# EAGLE schematic Grove - OLED Display 0.96 (SSD1315)_v1.0 (EAGLE 9.4.2)

## Sheet 1 of 2
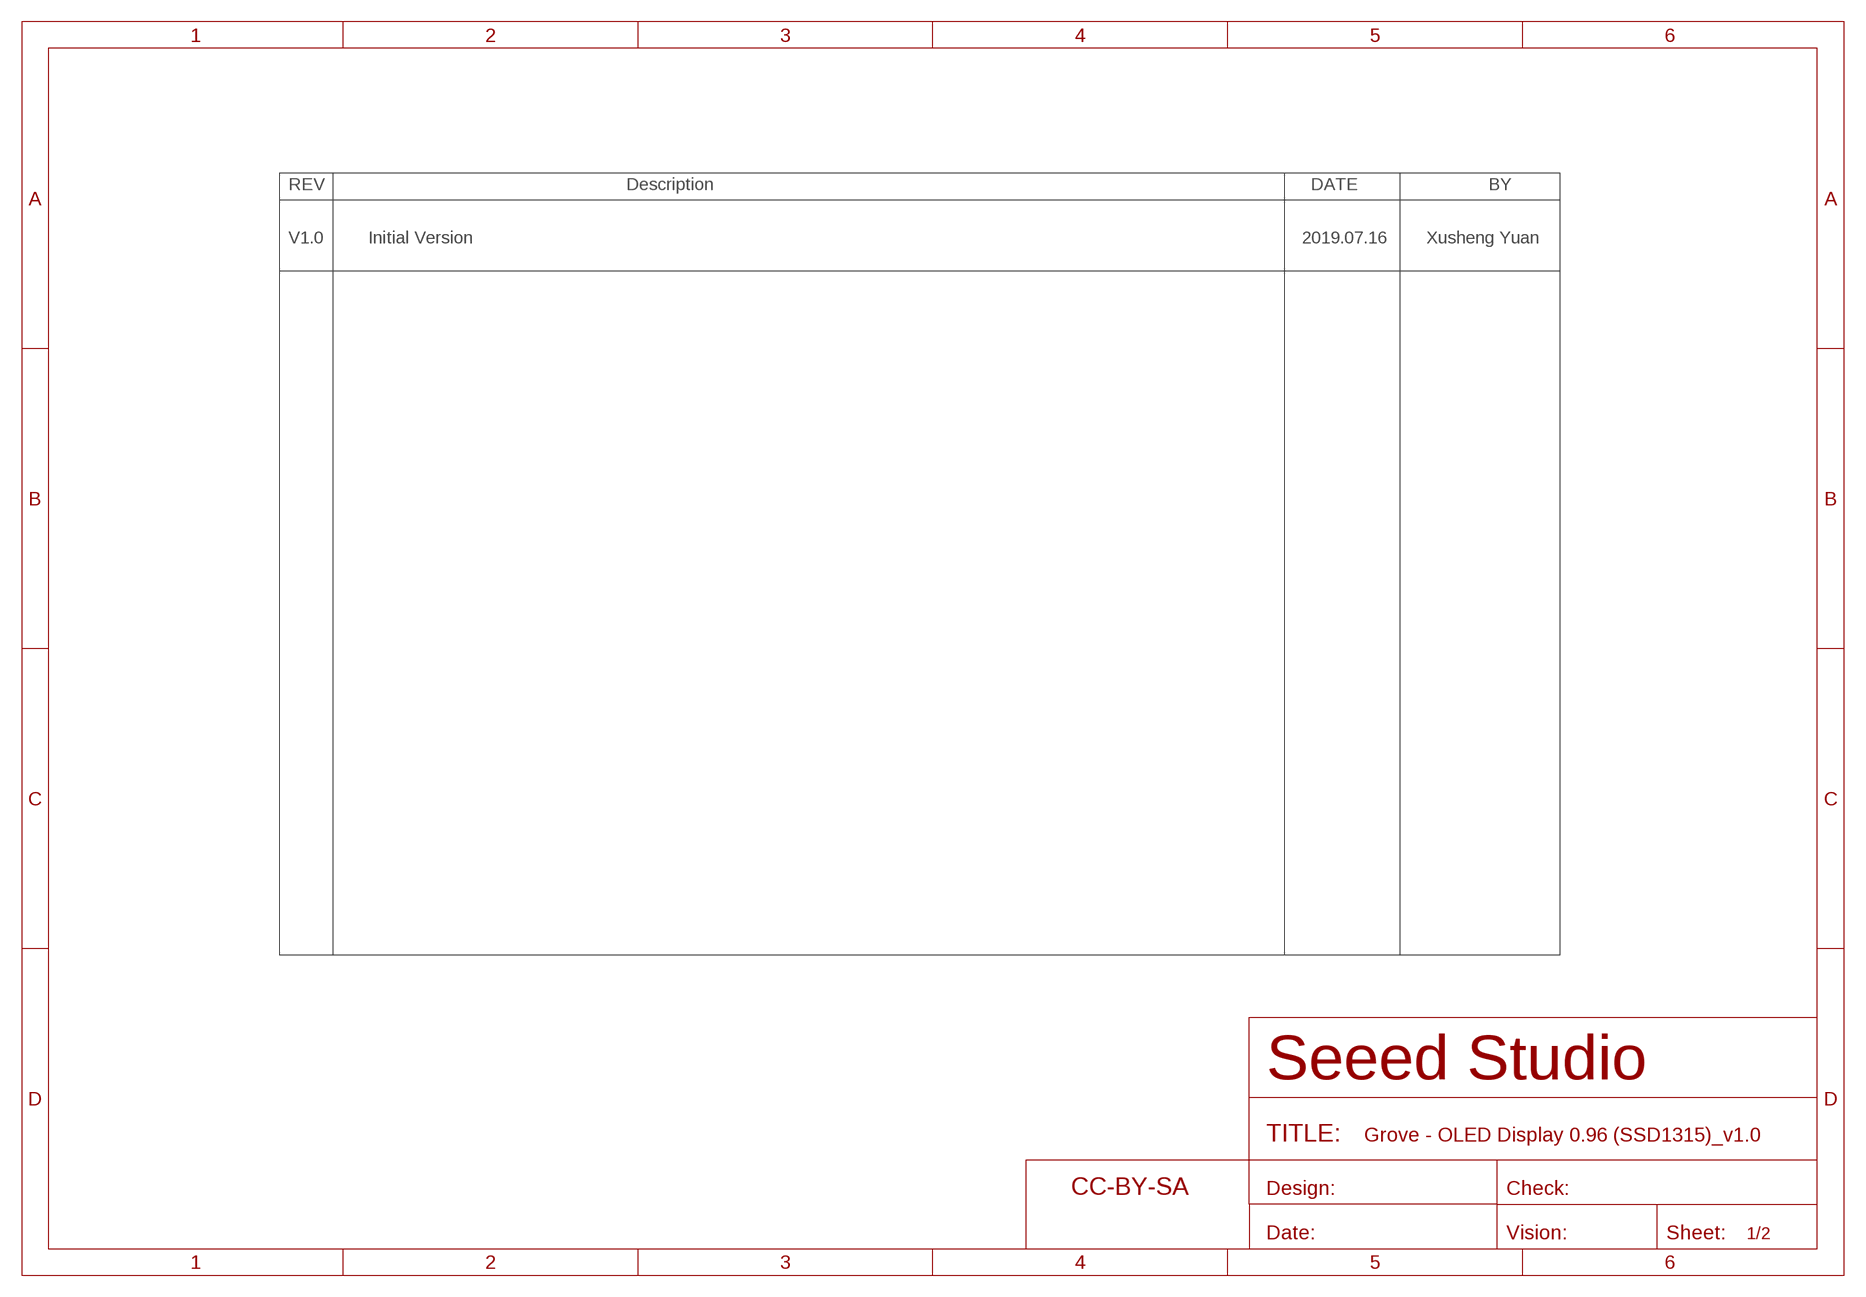
[diagram p0: schematic, sheet 1, part 1 of 2]
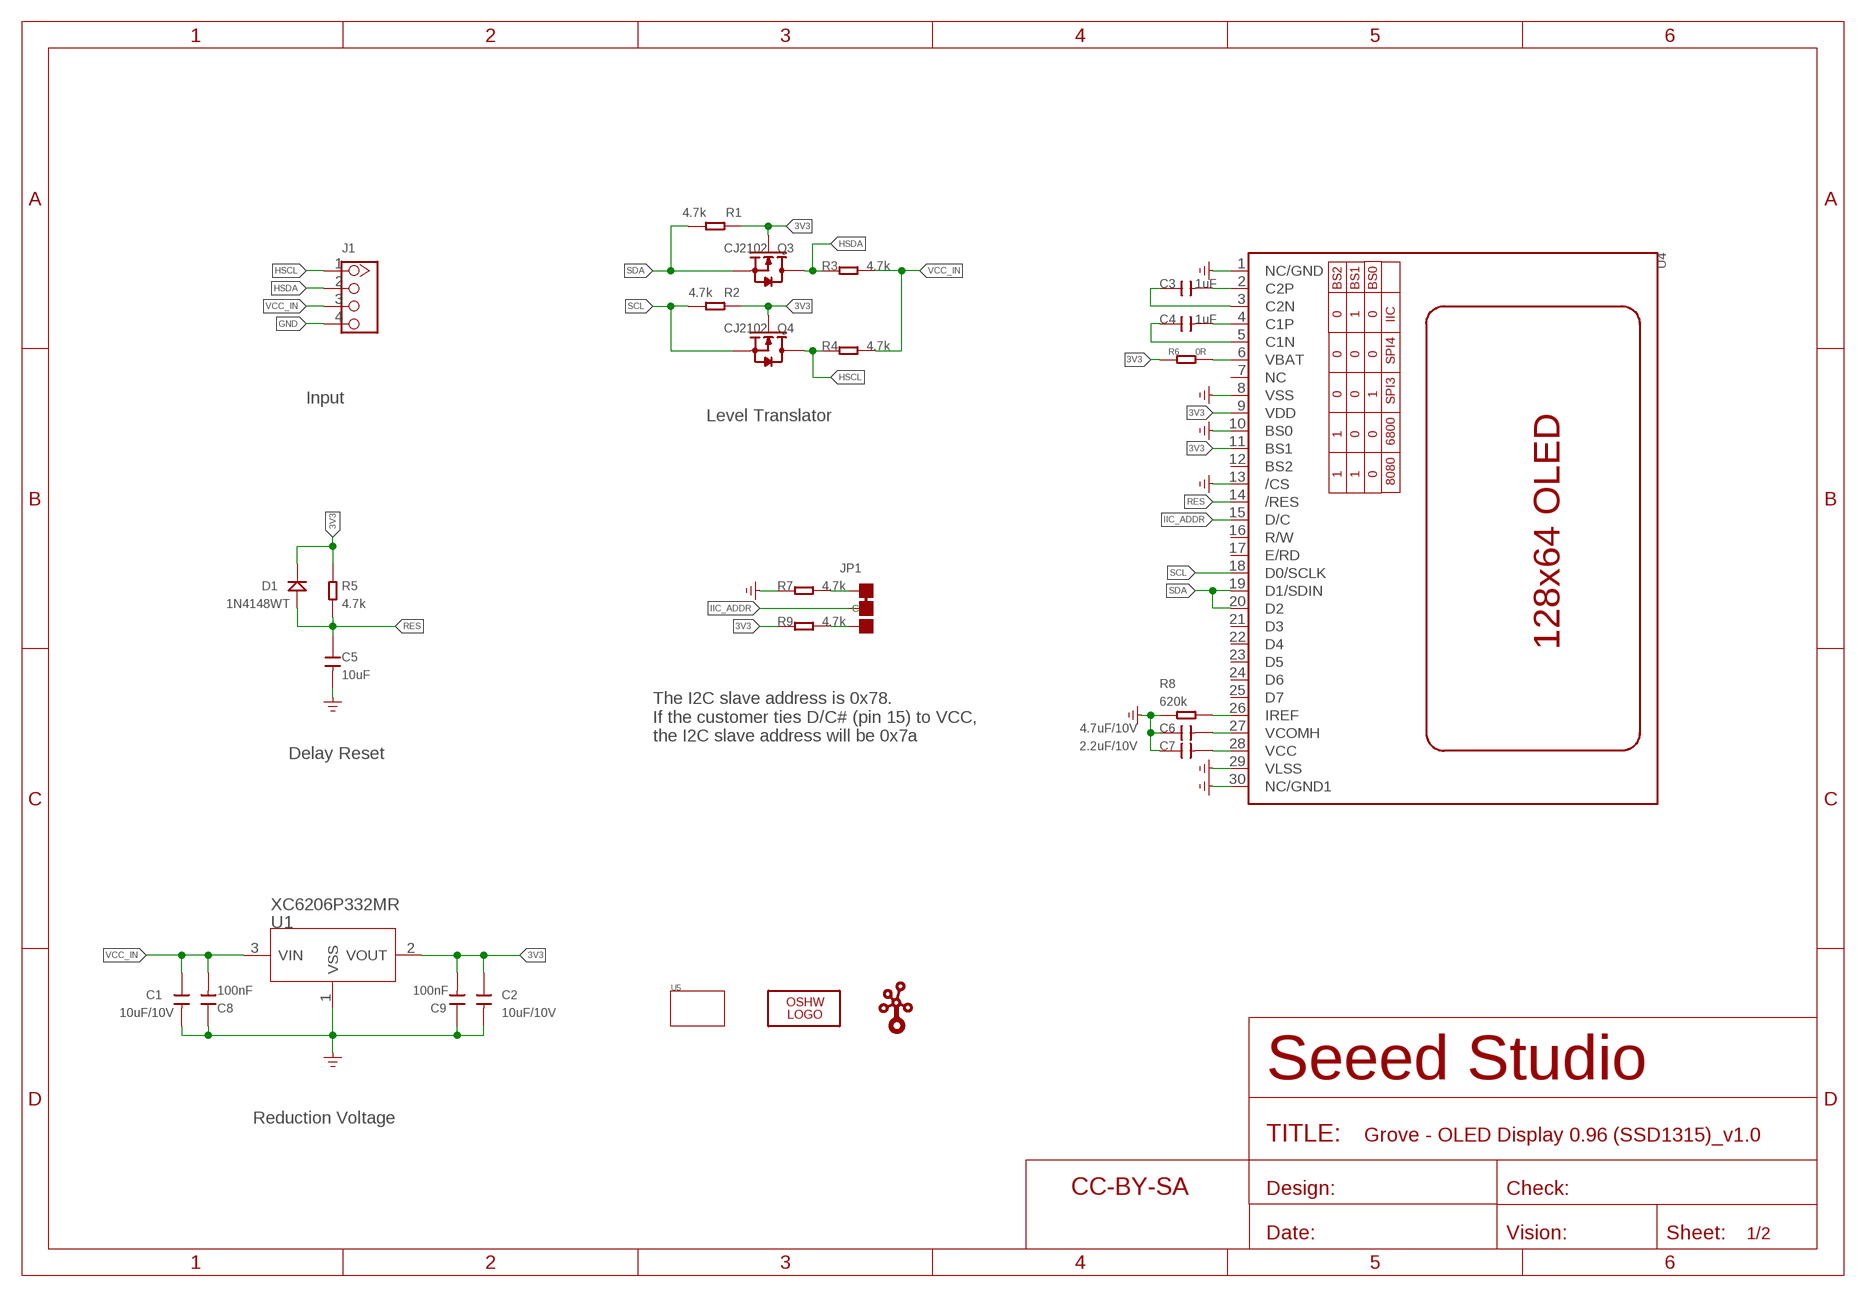
[diagram p1: schematic, sheet 1, part 2 of 2]

### Parts
C1  10uF/10V  C-0603  [C0603]
C2  10uF/10V  C-0603  [C0603]
C3  1uF  C-0402  [C0402]
C4  1uF  C-0402  [C0402]
C5  10uF  C-0603  [C0603]
C6  4.7uF/10V  C-0603  [C0603]
C7  2.2uF/10V  C-0603  [C0603]
C8  100nF  C-0402  [C0402]
C9  100nF  C-0402  [C0402]
D1  1N4148WT  DIODE'0603'  [SOD-523]
FR1  SEEEDSTUDIO-OPEN-SCH-FRAME  [SEEEDSTUDIO-PCB-FRAME]
FR2  SEEEDSTUDIO-OPEN-SCH-FRAME  [SEEEDSTUDIO-PCB-FRAME]
J1  GROVE-CONNECTOR-DIP-320110033  [HW4-2.0]
JP1  JP-3P-SHORT  [3P-SMD-SHORT]
LOGO1  LOGO-OSHW-FILLX0150-NT  [OSHW_FILLX150_NOTEXT]
Q3  CJ2102  MOSFET-N'SI1304BDL'  [SOT-323]
Q4  CJ2102  MOSFET-N'SI1304BDL'  [SOT-323]
R1  4.7k  R-0402  [R0402]
R2  4.7k  R-0402  [R0402]
R3  4.7k  R-0402  [R0402]
R4  4.7k  R-0402  [R0402]
R5  4.7k  R-0402  [R0402]
R6  0R  R-0402  [R0402]
R7  4.7k  R-0402  [R0402]
R8  620k  R-0402  [R0402]
R9  4.7k  R-0402  [R0402]
U1  XC6206P332MR  PMIC-XC6206PMR  [SOT-23]
U4  OLED-12864-30P  [OLED30P-0.7-24.74X16.9MM]
U5  TWIG'2U'  [2U-DIM-W/DRILL]
U$1  LOGO-GROVETWIGLOGO_SMALL  [GROVE-SILK-SMALL]

### Nets
3V3: C2.1 C9.2 D1.- Q3.1(G) Q4.1(G) R1.1 R2.2 R5.2 R6.1 R9.1 U1.2(VOUT) U4.9(VDD) U4.11(BS1)
GND: C1.2 C2.2 C5.2 C6.1 C7.1 C8.1 C9.1 J1.4 R7.1 R8.2 U1.1(VSS) U4.1(NC/GND) U4.8(VSS) U4.10(BS0) U4.13(/CS) U4.29(VLSS) U4.30(NC/GND1) ; supply symbol labelled GND_POWER
HSCL: J1.1 Q4.3(D) R4.1
HSDA: J1.2 Q3.3(D) R3.1
IIC_ADDR: JP1.MM(C) U4.15(D/C)
N$1: C3.2 U4.2(C2P)
N$2: C4.2 U4.4(C1P)
N$3: C3.1 U4.3(C2N)
N$4: C4.1 U4.5(C1N)
N$5: R8.1 U4.26(IREF)
N$6: C6.2 U4.27(VCOMH)
N$7: C7.2 U4.28(VCC)
N$8: R6.2 U4.6(VBAT)
N$10: JP1.11(L) R7.2
N$11: JP1.00(R) R9.2
RES: C5.1 D1.+ R5.1 U4.14(/RES)
SCL: Q4.2(S) R2.1 U4.18(D0/SCLK)
SDA: Q3.2(S) R1.2 U4.19(D1/SDIN) U4.20(D2)
VCC_IN: C1.1 C8.2 J1.3 R3.2 R4.2 U1.3(VIN)
Unconnected: U4.7(NC) U4.12(BS2) U4.16(R/W) U4.17(E/RD) U4.21(D3) U4.22(D4) U4.23(D5) U4.24(D6) U4.25(D7)

### Notes on the sheet
- V1.0 | Initial Version | 2019.07.16 | Xusheng Yuan
- Input
- Level Translator
- The I2C slave address is 0x78.
  If the customer ties D/C# (pin 15) to VCC,
  the I2C slave address will be 0x7a
- Delay Reset
- Reduction Voltage

## Sheet 2 of 2

## Library data of the parts
C1-C9 = Discrete-small:C*: Ceramic Capacitors
D1 = Discrete-new:DIODE
FR1 FR2 = moudle-new:SEEEDSTUDIO-OPEN-SCH-FRAME
J1 = Connector-new:GROVE-CONNECTOR-DIP
JP1 = Discrete-new:JP-3P-SHORT
LOGO1 = logo:LOGO-OSHW-FILL; PARTNO: DNP
Q3 Q4 = Discrete-new:MOSFET-N: IRLL014: http://www.vishay.com/docs/91319/sihll014.pdf
R1-R9 = Discrete-small:R*
U1 = IC-new:PMIC-XC6206P: LOW ESR Cap.Compatible Positive Voltage Regulators
U4 = moudle-new:OLED-128*64-30P: 308020008
U5 = moudle:TWIG
U$1 = logo:LOGO-GROVE; PARTNO: DNP

## Net classes
0 default: width 0.152 mm, drill 0.254 mm, clearance 0.152 mm
1 power: width 0.152 mm, drill 0.254 mm, clearance 0.152 mm
2 gnd: width 0.152 mm, drill 0.254 mm, clearance 0.152 mm
3 usbvcc: width 0.152 mm, drill 0.254 mm, clearance 0.152 mm